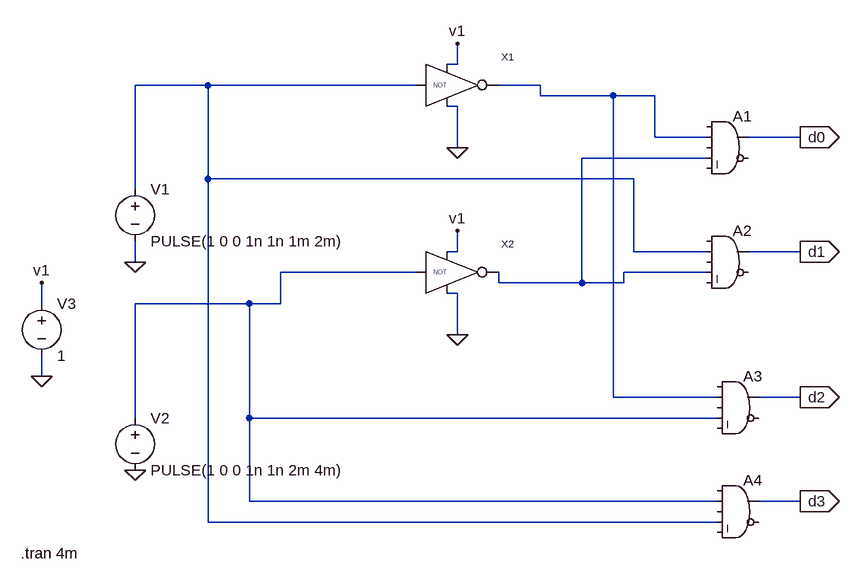
[diagram p0: schematic 2-4 decoder.asc]
2-4 decoder.asc, the LTspice schematic file:
Version 4
SHEET 1 880 680
WIRE -64 -128 -64 -160
WIRE -64 -128 -80 -128
WIRE -448 -96 -560 -96
WIRE -128 -96 -448 -96
WIRE 64 -96 0 -96
WIRE 64 -80 64 -96
WIRE 176 -80 64 -80
WIRE 240 -80 176 -80
WIRE -64 -64 -80 -64
WIRE 240 -16 240 -80
WIRE 320 -16 240 -16
WIRE 464 -16 384 -16
WIRE -64 0 -64 -64
WIRE 320 16 128 16
WIRE -448 48 -448 -96
WIRE 208 48 -448 48
WIRE -560 64 -560 -96
WIRE -64 160 -64 128
WIRE -64 160 -80 160
WIRE 208 160 208 48
WIRE 320 160 208 160
WIRE 464 160 384 160
WIRE -560 176 -560 144
WIRE -128 192 -336 192
WIRE 320 192 192 192
WIRE 0 208 0 192
WIRE 128 208 128 16
WIRE 128 208 0 208
WIRE 192 208 192 192
WIRE 192 208 128 208
WIRE -64 224 -80 224
WIRE -704 240 -704 208
WIRE -384 240 -560 240
WIRE -336 240 -336 192
WIRE -336 240 -384 240
WIRE -64 288 -64 224
WIRE -704 352 -704 320
WIRE 176 384 176 -80
WIRE 336 384 176 384
WIRE 464 384 400 384
WIRE -560 416 -560 240
WIRE -384 416 -384 240
WIRE 336 416 -384 416
WIRE -384 544 -384 416
WIRE 336 544 -384 544
WIRE 464 544 400 544
WIRE -448 576 -448 48
WIRE 336 576 -448 576
FLAG -64 -160 v1
FLAG -64 128 v1
FLAG -704 208 v1
FLAG -560 176 0
FLAG -560 496 0
FLAG -704 352 0
FLAG -64 0 0
FLAG -64 288 0
FLAG 464 -16 d0
IOPIN 464 -16 Out
FLAG 464 160 d1
IOPIN 464 160 Out
FLAG 464 384 d2
IOPIN 464 384 Out
FLAG 464 544 d3
IOPIN 464 544 Out
SYMBOL Digital\\and 352 -64 R0
SYMATTR InstName A1
SYMBOL Digital\\and 352 112 R0
SYMATTR InstName A2
SYMBOL Digital\\and 368 336 R0
SYMATTR InstName A3
SYMBOL Digital\\and 368 496 R0
SYMATTR InstName A4
SYMBOL NOT4 -64 -80 R0
SYMATTR InstName X1
SYMBOL NOT4 -64 208 R0
SYMATTR InstName X2
SYMBOL voltage -560 48 R0
WINDOW 123 0 0 Left 0
WINDOW 39 0 0 Left 0
SYMATTR InstName V1
SYMATTR Value PULSE(1 0 0 1n 1n 1m 2m)
SYMBOL voltage -560 400 R0
WINDOW 123 0 0 Left 0
WINDOW 39 0 0 Left 0
SYMATTR InstName V2
SYMATTR Value PULSE(1 0 0 1n 1n 2m 4m)
SYMBOL voltage -704 224 R0
WINDOW 123 0 0 Left 0
WINDOW 39 0 0 Left 0
SYMATTR InstName V3
SYMATTR Value 1
TEXT -736 624 Left 2 !.tran 4m

The netlist it stands for:
* 2-4 decoder.asc
A1 0 N002 0 N003 0 0 d0 0 AND
A2 0 N001 0 N003 0 0 d1 0 AND
A3 0 N002 0 N004 0 0 d2 0 AND
A4 0 N004 0 N001 0 0 d3 0 AND
XX1 N001 v1 0 N002 NOT4  ; pins A VH VL OUT
XX2 N004 v1 0 N003 NOT4  ; pins A VH VL OUT
V1 N001 0 PULSE(1 0 0 1n 1n 1m 2m)
V2 N004 0 PULSE(1 0 0 1n 1n 2m 4m)
V3 v1 0 1
.tran 4m
.backanno
.end